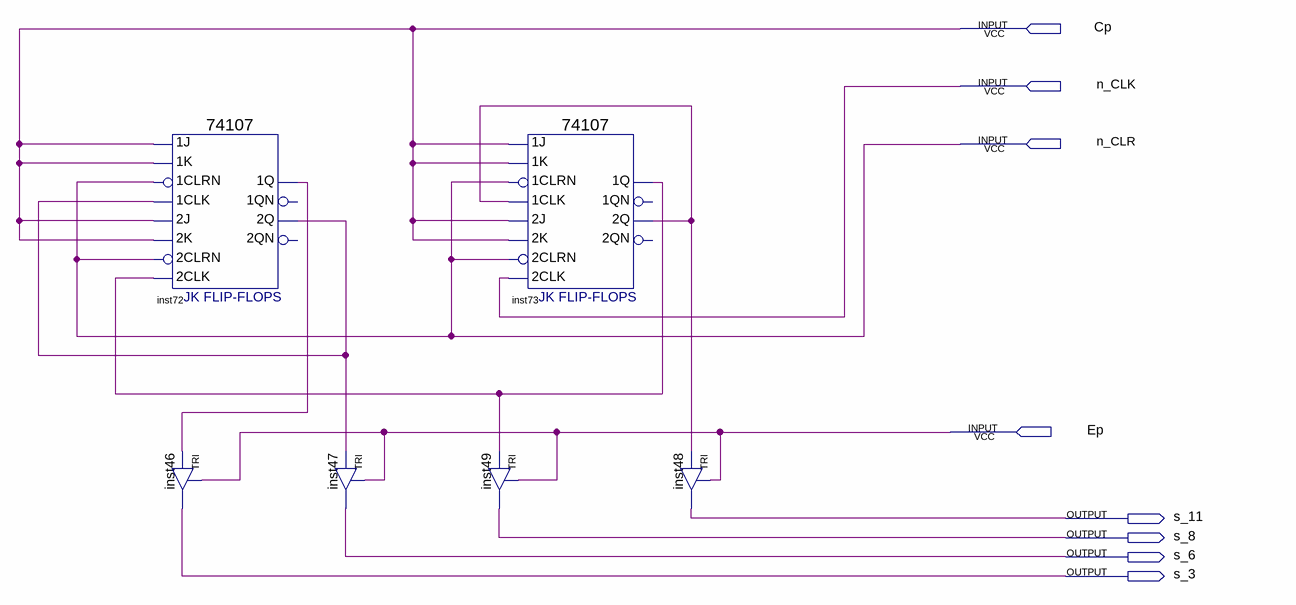
[diagram p0: schematic sheet]
// Quartus schematic ContadordeProgramas.bdf as structural Verilog: 6 symbols, 8 pins
module ContadordeProgramas (
  input  Cp,
  input  n_CLK,
  input  n_CLR,
  input  Ep,
  output s_11,
  output s_8,
  output s_6,
  output s_3
);

  wire inst72_1q, inst72_2q, inst73_1q, inst73_2q;

  \74107  inst72 (
    .\1CLRN (n_CLR), .\1K (Cp), .\1J (Cp), .\2K (Cp), .\2J (Cp), .\1CLK (inst72_2q), .\2CLK (inst73_1q),
    .\2CLRN (n_CLR), .\1Q (inst72_1q), .\2Q (inst72_2q));  // open: 1QN, 2QN
  TRI inst46 (.IN(inst72_1q), .OE(Ep), .OUT(s_3));
  TRI inst47 (.IN(inst72_2q), .OE(Ep), .OUT(s_6));
  \74107  inst73 (
    .\1CLRN (n_CLR), .\1K (Cp), .\1J (Cp), .\2K (Cp), .\2J (Cp), .\1CLK (inst73_2q), .\2CLK (n_CLK),
    .\2CLRN (n_CLR), .\1Q (inst73_1q), .\2Q (inst73_2q));  // open: 1QN, 2QN
  TRI inst49 (.IN(inst73_1q), .OE(Ep), .OUT(s_8));
  TRI inst48 (.IN(inst73_2q), .OE(Ep), .OUT(s_11));
endmodule
